# Altium schematic sheet FOC主控（未用）.SchDoc
size A4
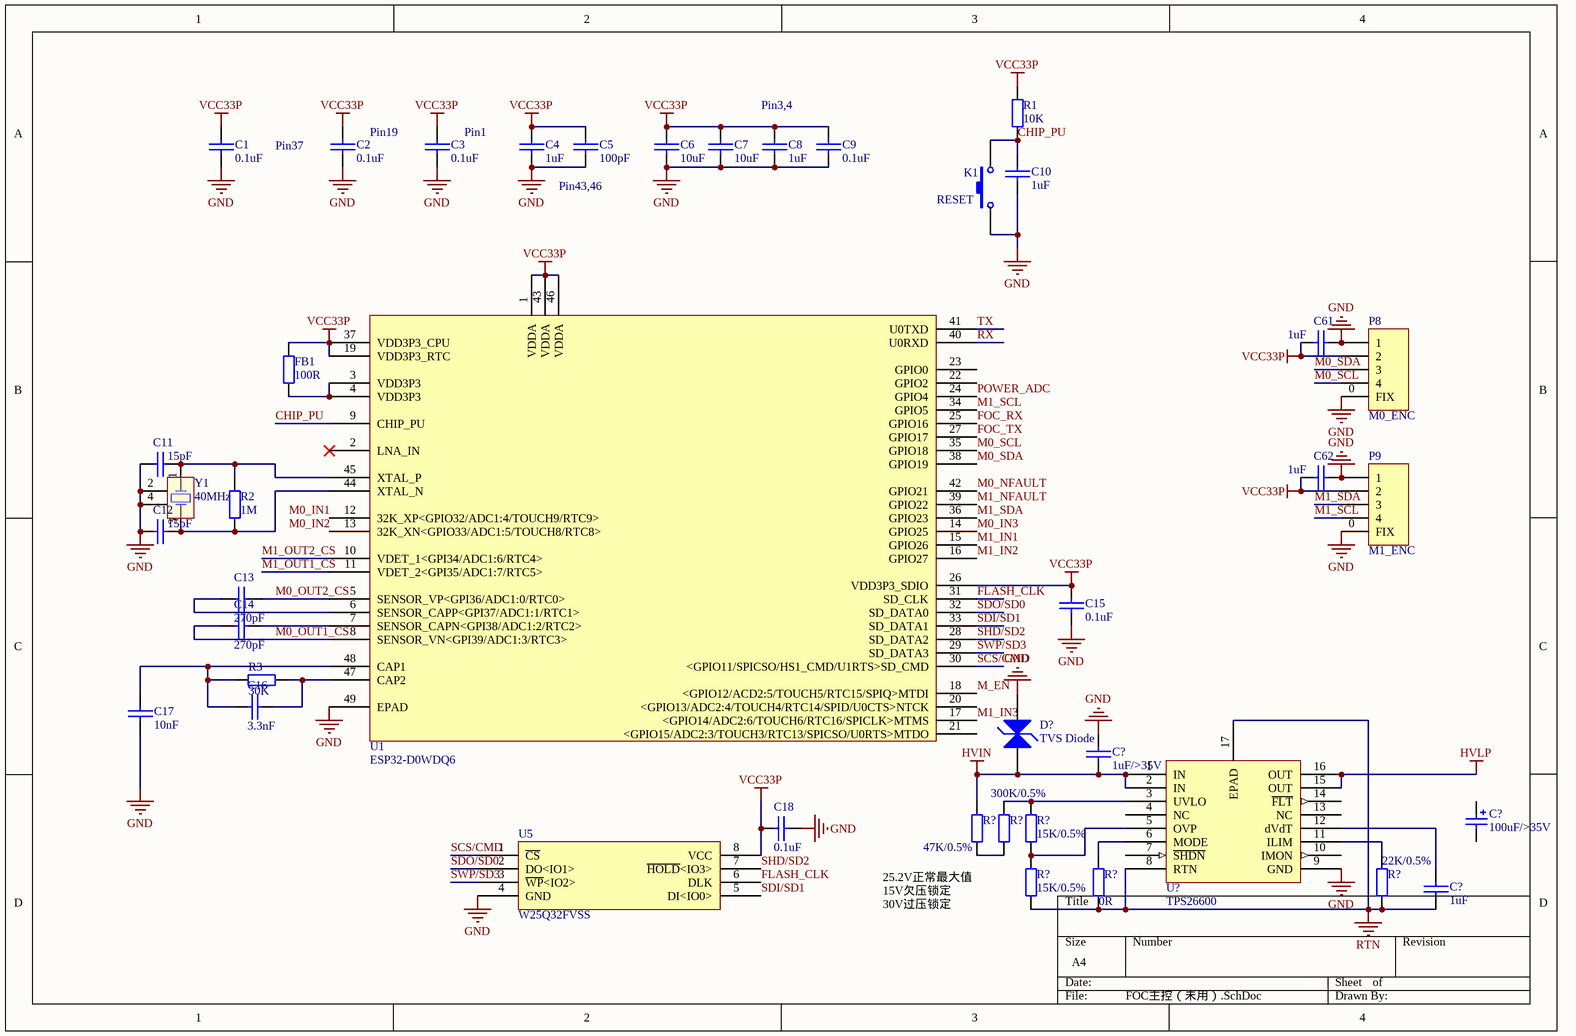
[diagram p0: FOC主控（未用）.SchDoc]

## Parts
(Parts that share a designator on the sheet are numbered #1, #2 ... from top to bottom, then left to right.)
C1  0.1uF  [C0805_M]
C2  0.1uF  [C0805_M]
C3  0.1uF  [C0805_M]
C4  1uF  [C0805_M]
C5  100pF  [C0805_M]
C6  10uF  [C0805_M]
C7  10uF  [C0805_M]
C8  1uF  [C0805_M]
C9  0.1uF  [C0805_M]
C10  1uF  [C0805_M]
C11  15pF  [C0805_M]
C12  15pF  [C0805_M]
C13  270pF  [C0805_M]
C14  270pF  [C0805_M]
C15  0.1uF  [C0805_M]
C16  3.3nF  [C0805_M]
C17  10nF  [C0805_M]
C18  0.1uF  [C0805_M]
C61  1uF  [C0805_M]
C62  1uF  [C0805_M]
C?#1  1uF/>35V  [C0805_M]
C?#2  100uF/>35V  [CS 6*6 - R]
C?#3  1uF  [C0805_M]
D?  TVS Diode  [SMB]
FB1  100R  [R0805_M]
K1  RESET  [KEY_M]
P8  M0_ENC  [SH1.0-WT-4P]
P9  M1_ENC  [SH1.0-WT-4P]
R1  10K  [R0805_M]
R2  1M  [R0805_M]
R3  30K  [R0805_M]
R?#1  47K/0.5%  [R0805_M]
R?#2  300K/0.5%  [R0805_M]
R?#3  15K/0.5%  [R0805_M]
R?#4  15K/0.5%  [R0805_M]
R?#5  0R  [R0805_M]
R?#6  22K/0.5%  [R0805_M]
U1  ESP32-D0WDQ6  [QFN-48_L5.0-W5.0-P0.35-BL-EP3.7]
U5  W25Q32FVSS  [SOIC-8W]
U?  TPS26600  [ETSSOP16_M]
Y1  40MHz  [OSC-3225-4P]

## Nets
GND: C1.2 C2.2 C3.2 C4.2 C5.2 C6.2 C7.2 C8.2 C9.2 C10.1 C11.1 C12.1 C15.2 C17.2 C18.2 C61.2 C62.2 C?#1.2 D?.2(K) K1.1 P8.0(FIX) P8.1 P9.0(FIX) P9.1 U1.49(EPAD) U5.4(GND) U?.9(GND) Y1.2(GND) Y1.4(GND)
HVIN: C?#1.1 D?.1(A) R?#1.1 U?.1(IN) U?.2(IN)
HVLP: U?.15(OUT) U?.16(OUT)
RTN: C?#3.2 R?#4.2 R?#5.2 R?#6.2 U?.8(RTN) U?.17(EPAD)
VCC33P: C1.1 C2.1 C3.1 C4.1 C5.1 C6.1 C7.1 C8.1 C9.1 C15.1 C18.1 C61.1 C62.1 FB1.1 P8.2 P9.2 R1.1 U1.1(VDDA) U1.19(VDD3P3_RTC) U1.26(VDD3P3_SDIO) U1.37(VDD3P3_CPU) U1.43(VDDA) U1.46(VDDA) U5.8(VCC)
CHIP_PU: C10.2 K1.2 R1.2 U1.9(CHIP_PU)
FLASH_CLK: U1.31(SD_CLK) U5.6(DLK)
FOC_RX: U1.25(GPIO16)
FOC_TX: U1.27(GPIO17)
M0_IN3: U1.14(GPIO25)
M0_NFAULT: U1.42(GPIO21)
M0_OUT1_CS: C14.2 U1.8(SENSOR_VN<GPI39/ADC1:3/RTC3>)
M0_OUT2_CS: C13.1 U1.5(SENSOR_VP<GPI36/ADC1:0/RTC0>)
M0_SCL: P8.4 U1.35(GPIO18)
M0_SDA: P8.3 U1.38(GPIO19)
M1_IN1: U1.15(GPIO26)
M1_IN2: U1.16(GPIO27)
M1_IN3: U1.17(<GPIO14/ADC2:6/TOUCH6/RTC16/SPICLK>MTMS)
M1_NFAULT: U1.39(GPIO22)
M1_OUT1_CS: U1.11(VDET_2<GPI35/ADC1:7/RTC5>)
M1_OUT2_CS: U1.10(VDET_1<GPI34/ADC1:6/RTC4>)
M1_SCL: P9.4 U1.34(GPIO5)
M1_SDA: P9.3 U1.36(GPIO23)
M_EN: U1.18(<GPIO12/ACD2:5/TOUCH5/RTC15/SPIQ>MTDI)
POWER_ADC: U1.24(GPIO4)
RX: U1.40(U0RXD)
SCS/CMD: U1.30(<GPIO11/SPICSO/HS1_CMD/U1RTS>SD_CMD) U5.1(~{CS})
SDI/SD1: U1.33(SD_DATA1) U5.5(DI<IO0>)
SDO/SD0: U1.32(SD_DATA0) U5.2(DO<IO1>)
SHD/SD2: U1.28(SD_DATA2) U5.7(~{HOLD}<IO3>)
SWP/SD3: U1.29(SD_DATA3) U5.3(~{WP}<IO2>)
TX: U1.41(U0TXD)
NetC11_2: C11.2 R2.1 U1.45(XTAL_P) Y1.1(OSC1)
NetC12_2: C12.2 R2.2 U1.44(XTAL_N) Y1.3(OSC2)
NetC13_2: C13.2 U1.6(SENSOR_CAPP<GPI37/ADC1:1/RTC1>)
NetC14_1: C14.1 U1.7(SENSOR_CAPN<GPI38/ADC1:2/RTC2>)
NetC16_1: C16.1 C17.1 R3.1 U1.48(CAP1)
NetC16_2: C16.2 R3.2 U1.47(CAP2)
NetC?#3_1: C?#3.1 U?.12(dVdT)
NetFB1_2: FB1.2 U1.3(VDD3P3) U1.4(VDD3P3)
NetR?#1_2: R?#1.2 R?#2.2
NetR?#2_1: R?#2.1 R?#3.1 U?.3(UVLO)
NetR?#3_2: R?#3.2 R?#4.1 U?.5(OVP)
NetR?#5_1: R?#5.1 U?.6(MODE)
NetR?#6_1: R?#6.1 U?.11(ILIM)

Not connected (* = marked no-connect by the designer): C?#2 1 2; U1 2(LNA_IN)* 12(32K_XP<GPIO32/ADC1:4/TOUCH9/RTC9>) 13(32K_XN<GPIO33/ADC1:5/TOUCH8/RTC8>) 20(<GPIO13/ADC2:4/TOUCH4/RTC14/SPID/U0CTS>NTCK) 21(<GPIO15/ADC2:3/TOUCH3/RTC13/SPICSO/U0RTS>MTDO) 22(GPIO2) 23(GPIO0); U? 4(NC) 7(~{SHDN}) 10(IMON) 13(NC) 14(~{FLT})

## Notes on the sheet
- Pin3,4
- Pin37
- Pin19
- Pin1
- Pin43,46
- (near R?#4) 25.2V正常最大值
  15V欠压锁定
  30V过压锁定
- Labels drawn without touching a wire or pin: M0_IN1, M0_IN2

## Library data of the parts
C1-C18 C61 C62 C?#1 C?#3 = CAP: Capacitor
C?#2 = Cap Pol2: 固态电容; Published: 8-Jun-2000; LatestRevisionDate: 17-Jul-2002; LatestRevisionNote: Re-released for DXP Platform.; PackageReference: POLAR0.8; Publisher: Altium Limited; PackageDescription: Polarized Capacitor; 2 Leads
D? = TVS
FB1 R1-R3 R?#1-R?#6 = Res2: Resistor; Value: 1K; Published: 8-Jun-2000; LatestRevisionDate: 17-Jul-2002; LatestRevisionNote: Re-released for DXP Platform.; PackageReference: AXIAL-0.4; Publisher: Altium Limited; PackageDescription: Axial Device, Thru-Hole; 2 Leads; 0.4 in Pin Spacing
K1 = SW-PB: Switch; Published: 24-Mar-1999; LatestRevisionDate: 17-Jul-2002; LatestRevisionNote: Re-released for DXP Platform.; PackageReference: SPST-2; Publisher: Altium Limited; PackageDescription: Switch; 2 Leads
P8 P9 = Header 5: LatestRevisionDate: 17-Jul-2002; LatestRevisionNote: Re-released for DXP Platform.; Publisher: Altium Limited
Y1 = XTAL-4: CL=15pF; Published: 8-Jun-2000; LatestRevisionDate: 17-Jul-2002; LatestRevisionNote: Re-released for DXP Platform.; PackageReference: R38; Publisher: Altium Limited; PackageDescription: Crystal, Thru-Hole; 2 Leads; Body 3.1 x 8.2 mm (Dia.xH)